# Altium schematic sheet Discharge.SchDoc
size A
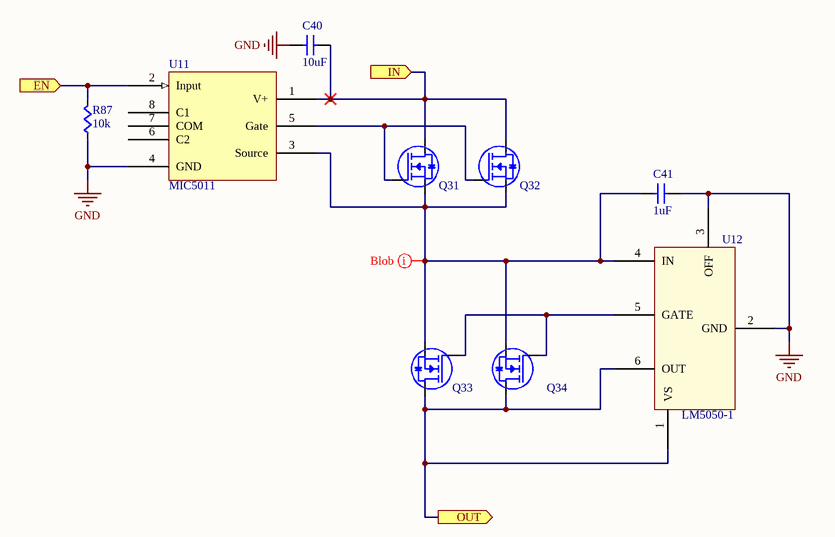
[diagram p0: Discharge.SchDoc]

## Parts
C40  value 10uF  [CAPC1206]  (hidden comment: Cap)
C41  value 1uF  [CAPC0805]  (hidden comment: Cap)
Q31  IRFB3306PbF  [TO-220AB Heatsink]  (value not drawn)
Q32  IRFB3306PbF  [TO-220AB Heatsink]  (value not drawn)
Q33  IRFB3306PbF  [TO-220AB Heatsink]  (value not drawn)
Q34  IRFB3306PbF  [TO-220AB Heatsink]  (value not drawn)
R87  value 10k  [RES0603]  (hidden comment: Res)
U11  MIC5011  [MIC5011]
U12  LM5050-1  [LM5050]

## Ports
EN (in), IN (in), OUT (out)

## Nets
GND: C40.1(A) C41.1(A) R87.2(B) U11.4(GND) U12.2(GND) U12.3(OFF)
EN: R87.1(A) U11.2(Input) ; port EN
IN: C40.2(B) Q31.D Q32.D U11.1(V+) ; port IN
OUT: Q33.D Q34.D U12.1(VS) U12.6(OUT) ; port OUT
NetC41_2: C41.2(B) Q31.S Q32.S Q33.S Q34.S U11.3(Source) U12.4(IN)
NetQ31_G: Q31.G Q32.G U11.5(Gate)
NetQ33_G: Q33.G Q34.G U12.5(GATE)

Not connected (* = marked no-connect by the designer): U11 6(C2) 7(COM) 8(C1)

## Layout directives
net class Blob: NetC41_2

## Library data of the parts
Q31-Q34 = IRFx3306PbF: HEXFET Power MOSFET; Heatsink: A10755-ND; Supplier 1: Digi-Key; Supplier Part Number 1: IRFB3306PBF-ND
U11 = MIC5011: Minimum Parts High- or Low-Side MOSFET Driver; Supplier 1: Digi-Key; Supplier Part Number 1: 576-1230-ND
U12 = LM5050: High-Side OR-ing FET Controller; Supplier 1: Digi-Key; Supplier Part Number 1: LM5050MK-1/NOPBCT-ND
C40 C41 = Cap: Supplier 1: Digi-Key
  C40: Supplier Part Number 1: 1276-2876-1-ND
  C41: Supplier Part Number 1: 1276-1029-1-ND
R87 = Res: Supplier 1: Digi-Key; Supplier Part Number 1: RMCF0603JT10K0CT-ND